# Altium project 调偏电路.PrjPcb
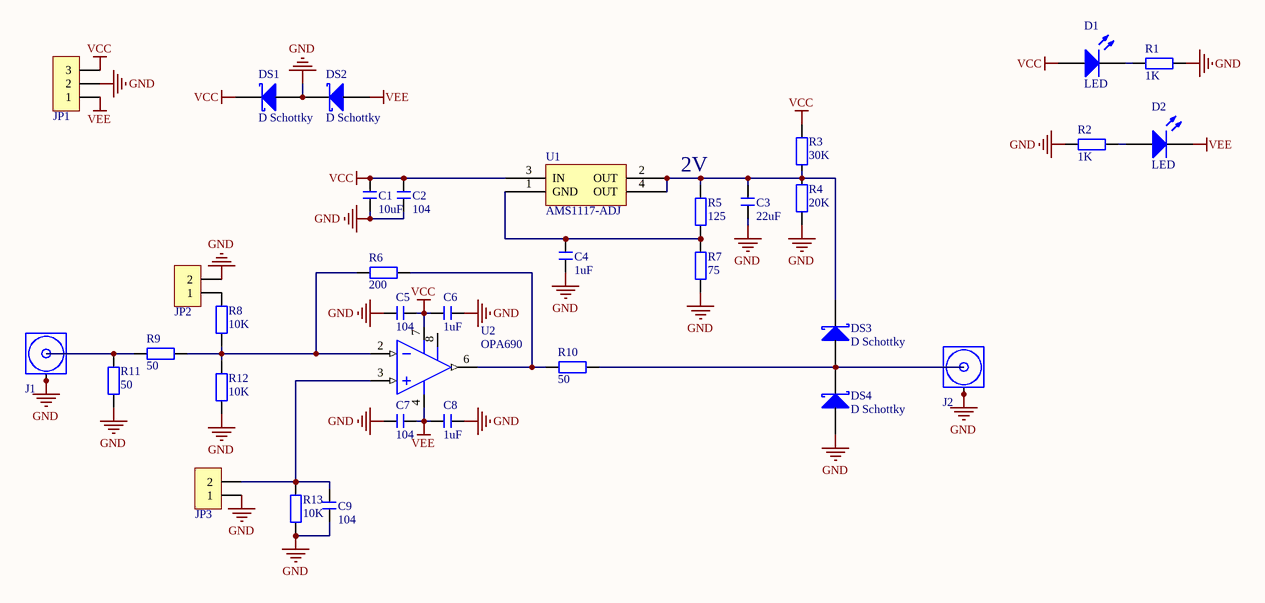
[diagram p0: 调偏电路.SchDoc]
1 sheet, 35 parts. Net scope: global (net labels, ports and power ports of the same name join across sheets).
Board file: 调偏电路.PcbDoc

## Sheet 调偏电路.SchDoc
size A4

### Parts
C1  10uF  [C 0805]
C2  104  [C 0603]
C3  22uF  [C 0805]
C4  1uF  [C 0805]
C5  104  [C 0603]
C6  1uF  [C 0603]
C7  104  [C 0603]
C8  1uF  [C 0603]
C9  104  [C 0603]
D1  LED  [LED_0805]
D2  LED  [LED_0805]
DS1  D Schottky  [DIODE-SMA]
DS2  D Schottky  [DIODE-SMA]
DS3  D Schottky  [DIODE-SMA]
DS4  D Schottky  [DIODE-SMA]
J1  COAX  [MCX5.08-5-H]  (value not drawn)
J2  COAX  [MCX5.08-5-H]  (value not drawn)
JP1  HDR-1X3  [XH2.54-3P_H]  (value not drawn)
JP2  HDR-1X2  [HDR-1X2]  (value not drawn)
JP3  HDR-1X2  [HDR-1X2]  (value not drawn)
R1  1K  [R 0805]
R2  1K  [R 0805]
R3  30K  [R 0603]
R4  20K  [R 0603]
R5  125  [R 0603]
R6  200  [R 0603]
R7  75  [R 0603]
R8  10K  [R 0603]
R9  50  [R 0603]
R10  50  [R 0603]
R11  50  [R 0603]
R12  10K  [R 0603]
R13  10K  [R 0603]
U1  AMS1117-ADJ  [SOT223_N]
U2  OPA690  [SOIC8_N]

### Nets
GND: C1.1 C2.1 C3.1 C4.1 C5.1 C6.2 C7.1 C8.2 C9.1 DS1.1 DS2.2 DS4.1 J1.2(GND) J1.3(GND) J1.4(GND) J1.5(GND) J2.2(GND) J2.3(GND) J2.4(GND) J2.5(GND) JP1.2 JP2.2 JP3.1 R1.2 R2.1 R4.1 R7.1 R11.1 R12.1 R13.1
VCC: C1.2 C2.2 C5.2 C6.1 D1.1(A) DS1.2 JP1.3 R3.1 U1.3(IN) U2.7(V+)
VEE: C7.2 C8.1 D2.2(K) DS2.1 JP1.1 U2.4(V-)
NetC3_2: C3.2 DS3.2 R3.2 R4.2 R5.1 U1.2(OUT) U1.4(OUT)
NetC4_2: C4.2 R5.2 R7.2 U1.1(GND)
NetC9_2: C9.2 JP3.2 R13.2 U2.3(IN+)
NetD1_2: D1.2(K) R1.1
NetD2_1: D2.1(A) R2.2
NetDS3_1: DS3.1 DS4.2 J2.1(Signal) R10.2
NetJ1_1: J1.1(Signal) R9.1 R11.2
NetJP2_1: JP2.1 R8.1
NetR6_1: R6.1 R8.2 R9.2 R12.2 U2.2(IN-)
NetR6_2: R6.2 R10.1 U2.6(OUT)

Not connected (* = marked no-connect by the designer): U2 8(DIS)

### Notes on the sheet
- (near R5) 2V

### Library data of the parts
C1-C9 = C: 无极性贴片电容; 版权归属: 源创客; BOM名称: 无极性贴片电容; 学习资源: www.ooocke.com
D1 D2 = LED: 发光二极管; Published: 8-Jun-2000; LatestRevisionDate: 08-Jul-2005; LatestRevisionNote: Mech Layer 1 removed.; PackageReference: LED; Publisher: Altium Limited
DS1-DS4 = D Schottky: Schottky Diode; Published: 8-Jun-2000; LatestRevisionDate: 17-Jul-2002; LatestRevisionNote: Re-released for DXP Platform.; PackageReference: SMB; Publisher: Altium Limited; PackageDescription: DO-214-AA/SMB; 2 C-Bend Leads; Body 5.3 x 3.6 mm, inc. leads (LxW); Code_JEDEC: DO-214-AA
JP1 = Header 3: 3P接插件; 版权归属: 源创客; BOM名称: 3P接插件; 学习资源: www.ooocke.com
JP2 JP3 = Header 2: 2P接插件; 版权归属: 源创客; BOM名称: 2P接插件; 学习资源: www.ooocke.com
R1-R13 = R: 贴片电阻; 版权归属: 源创客; BOM名称: 贴片电阻; 学习资源: www.ooocke.com
U1 = ASM1117: 线性稳压芯片
U2 = OPA690ID: 具有禁用功能的宽带电压反馈运算放大器